# Altium schematic sheet microphone_stage.SchDoc
size A
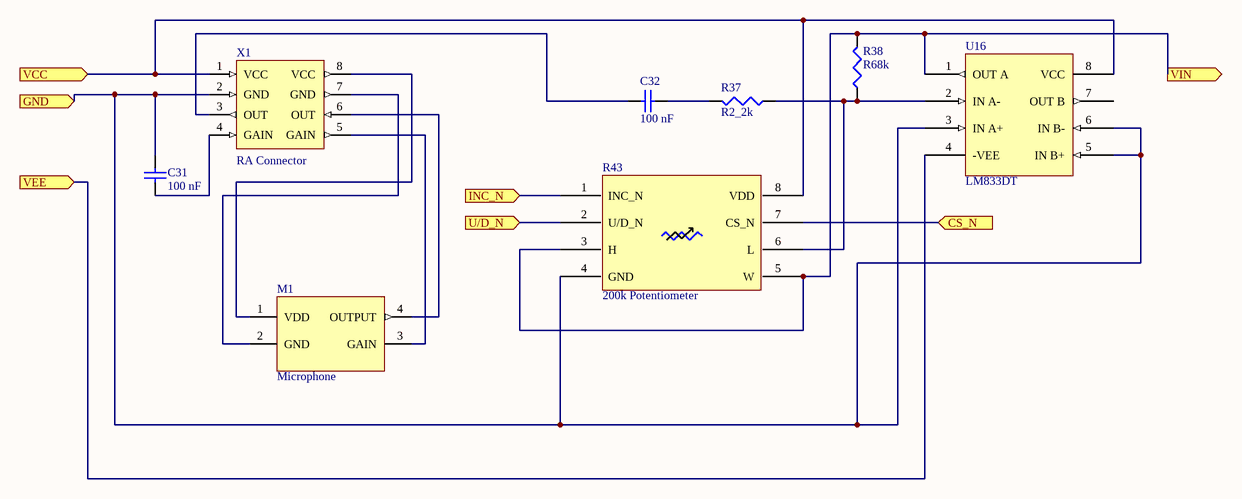
[diagram p0: microphone_stage.SchDoc]

## Parts
C31  100 nF  [C0603]
C32  100 nF  [C0603]
M1  Microphone  [SPU0414HR5H-SB-7]
R37  R2_2k  [R0603]
R38  R68k  [R0603]
R43  200k Potentiometer  [8-TSSOP]
U16  LM833DT  [soic8]
X1  RA Connector  [951104-7622-AR]

## Ports
CS_N (in), GND (in), INC_N (in), U/D_N (in), VCC (in), VEE (in), VIN (out)

## Nets
CS_N: R43.7(CS_N) ; port CS_N
GND: C31.2 R43.4(GND) U16.3(IN_A+) U16.5(IN_B+) U16.6(IN_B-) X1.2(GND) ; port GND
INC_N: R43.1(INC_N) ; port INC_N
U/D_N: R43.2(U/D_N) ; port U/D_N
VCC: R43.8(VDD) U16.8(VCC) X1.1(VCC) ; port VCC
VEE: U16.4(-VEE) ; port VEE
VIN: R38.2 R43.3(H) R43.5(W) U16.1(OUT_A) ; port VIN
NetC31_1: C31.1 X1.4(GAIN)
NetC32_1: C32.1 X1.3(OUT)
NetC32_2: C32.2 R37.2
NetM1_1: M1.1(VDD) X1.8(VCC)
NetM1_2: M1.2(GND) X1.7(GND)
NetM1_3: M1.3(GAIN) X1.5(GAIN)
NetM1_4: M1.4(OUTPUT) X1.6(OUT)
NetR37_1: R37.1 R38.1 R43.6(L) U16.2(IN_A-)

Not connected (* = marked no-connect by the designer): U16 7(OUT_B)

## Library data of the parts
C31 C32 = C100nF: 100 nF Surface Mount Capacitor; Manufacturer: Murata Electronics North America; Manufacturer Part Number: GRM188R71C104KA01D; Capacitance: 0.10µF; Tolerance: ±10%; Voltage - Rated: 16V; Temperature Coefficient: X7R; Supplier 1: Digi-Key; RoHS: RoHS Compliant; Category: Capacitors; Stock 1: 4165009; Pricing 1: 1=0.1, 10=0.019, 50=0.0102, 100=0.0086, 250=0.00704, 500=0.006, 1000=0.00468 (USD); Packaging: Digi-Reel®; Part Status: Active; Operating Temperature: -55°C ~ 125°C; Features: -; Ratings: -; Applications: General Purpose; Mounting Type: Surface Mount, MLCC; Package / Case: 0603 (1608 Metric); Size / Dimension: 0.063" L x 0.031" W (1.60mm x 0.80mm); Height - Seated (Max): -; Thickness (Max): 0.035" (0.90mm); Lead Spacing: -; Lead Style: -; ComponentLink1URL: http://www.murata.com/~/media/webrenewal/support/library/catalog/products/capacitor/mlcc/c02e.pdf; ComponentLink1Description: http://www.murata.com/~/media/webrenewal/support/library/catalog/products/capacitor/mlcc/c02e.pdf; Supplier Part Number 1: 490-1532-6-ND
M1 = SPU0414HR5H-SB-7: MIC MEMS ANALOG OMNI -22DB; Manufacturer: Knowles; Direction: Omnidirectional; Frequency Range: 100Hz ~ 10kHz; Sensitivity: -22dB ±3dB @ 94dB SPL; S/N Ratio: 59dB; Impedance: 400 Ohm; Voltage Range: 1.5 ~ 3.6V; Current - Supply: 220µA; Port Location: Top; Seal Rating: None; Shape: Rectangular; Supplier 1: Digi-Key; Manufacturer Part Number: SPU0414HR5H-SB-7; RoHS: RoHS Compliant; Category: Audio Products; Stock 1: 124760; Pricing 1: 1=2.01, 10=1.748, 25=1.3596, 50=1.23, 100=1.1005, 250=1.06812, 500=1.03576, 1000=0.93866 (USD); Packaging: Digi-Reel®; Part Status: Active; Type: MEMS (Silicon); Output Type: Analog; Voltage - Rated: -; Termination: Surface Mount; Size / Dimension: 3.76mm L x 2.95mm W; Height (Max): 1.20mm; ComponentLink1URL: http://www.knowles.com/eng/content/download/3915/49630/version/7/file/SPU0414HR5H-SB.pdf; ComponentLink1Description: http://www.knowles.com/eng/content/download/3915/49630/version/7/file/SPU0414HR5H-SB.pdf; Supplier Part Number 1: 423-1134-6-ND
R37 = R2_2k: 2.2k Ohms Surface Mount Resistor; Manufacturer: Yageo; Manufacturer Part Number: RC0603FR-072K2L; Tolerance: ±1%; Power (Watts): 0.1W, 1/10W; Temperature Coefficient: ±100ppm/°C; Supplier 1: Digi-Key; RoHS: RoHS Compliant; Category: Resistors; Stock 1: 4524664; Pricing 1: 1=0.1, 10=0.013, 25=0.0092, 50=0.007, 100=0.0052, 250=0.00396, 500=0.00316, 1000=0.00233 (USD); Packaging: Digi-Reel®; Part Status: Active; Resistance (Ohms): 2.2k; Composition: Thick Film; Features: Moisture Resistant; Operating Temperature: -55°C ~ 155°C; Package / Case: 0603 (1608 Metric); Supplier Device Package: 0603; Size / Dimension: 0.063" L x 0.031" W (1.60mm x 0.80mm); Height - Seated (Max): 0.022" (0.55mm); Number of Terminations: 2; Failure Rate: -; ComponentLink1URL: http://www.yageo.com/NewPortal/yageodocoutput?fileName=/pdf/R-Chip/PYu-RC_Group_51_RoHS_L_4.pdf; ComponentLink1Description: http://www.yageo.com/NewPortal/yageodocoutput?fileName=/pdf/R-Chip/PYu-RC_Group_51_RoHS_L_4.pdf; Supplier Part Number 1: 311-2.20KHRDKR-ND
R38 = R68k: 68k Ohms Surface Mount Resistor; Manufacturer: Panasonic Electronic Components; Manufacturer Part Number: ERJ-3EKF6802V; Tolerance: ±1%; Power (Watts): 0.1W, 1/10W; Temperature Coefficient: ±100ppm/°C; Supplier 1: Digi-Key; RoHS: RoHS Compliant; Category: Resistors; Stock 1: 139857; Pricing 1: 1=0.1, 10=0.019, 25=0.0136, 50=0.0104, 100=0.0077, 250=0.00584, 500=0.00468, 1000=0.00345 (USD); Packaging: Cut Tape (CT); Part Status: Active; Resistance (Ohms): 68k; Composition: Thick Film; Features: Automotive AEC-Q200; Operating Temperature: -55°C ~ 155°C; Package / Case: 0603 (1608 Metric); Supplier Device Package: 0603; Size / Dimension: 0.063" L x 0.031" W (1.60mm x 0.80mm); Height - Seated (Max): 0.022" (0.55mm); Number of Terminations: 2; Failure Rate: -; ComponentLink1URL: https://industrial.panasonic.com/cdbs/www-data/pdf/RDA0000/AOA0000C283.pdf; ComponentLink1Description: https://industrial.panasonic.com/cdbs/www-data/pdf/RDA0000/AOA0000C283.pdf; Supplier Part Number 1: P68.0KHCT-ND
R43 = MAX5160NEUA: 200k Digital Potentiometer (32 Tap); Manufacturer: Maxim Integrated; Manufacturer Part Number: MAX5160NEUA+; Number of Circuits: 1; Number of Taps: 32; Interface: Up/Down (U/D, INC, CS); Memory Type: Volatile; Voltage - Supply: 2.7 V ~ 5.5 V; Tolerance: ±25%; Temperature Coefficient (Typ): 50 ppm/°C; Resistance - Wiper (Ohms) (Typ): 400; Supplier 1: Digi-Key; RoHS: RoHS Compliant; Category: Integrated Circuits (ICs); Stock 1: 274; Pricing 1: 1=0.87, 10=0.83 (USD); Packaging: Tube; Part Status: Active; Taper: Linear; Configuration: Potentiometer; Resistance (Ohms): 200k; Features: -; Operating Temperature: -40°C ~ 85°C; Package / Case: 8-TSSOP, 8-MSOP (0.118", 3.00mm Width); Supplier Device Package: 8-uMAX; ComponentLink1URL: https://datasheets.maximintegrated.com/en/ds/MAX5160-MAX5161.pdf; ComponentLink1Description: https://datasheets.maximintegrated.com/en/ds/MAX5160-MAX5161.pdf; Supplier Part Number 1: MAX5160NEUA+-ND
U16 = LM833DT: IC Dual Audio Amplifier; Manufacturer: STMicroelectronics; Number of Circuits: 2; Slew Rate: 7 V/µs; Gain Bandwidth Product: 15MHz; Current - Input Bias: 300nA; Voltage - Input Offset: 300µV; Current - Supply: 4mA; Voltage - Supply, Single/Dual (±): 5 V ~ 30 V, ±2.5 V ~ 15 V; Supplier 1: Digi-Key; Manufacturer Part Number: LM833DT; RoHS: RoHS Compliant; Category: Integrated Circuits (ICs); Stock 1: 35363; Pricing 1: 1=0.45, 10=0.382, 100=0.2855, 500=0.22434, 1000=0.17335 (USD); Packaging: Cut Tape (CT); Part Status: Active; Amplifier Type: Audio; Output Type: -; -3db Bandwidth: -; Current - Output / Channel: -; Operating Temperature: -40°C ~ 105°C; Mounting Type: Surface Mount; Package / Case: 8-SOIC (0.154", 3.90mm Width); Supplier Device Package: 8-SO; ComponentLink1URL: http://www.st.com/content/ccc/resource/technical/document/datasheet/3b/52/12/a5/70/7c/44/0a/CD00000470.pdf/files/CD00000470.pdf/jcr:content/translations/en.CD00000470.pdf; ComponentLink1Description: http://www.st.com/content/ccc/resource/technical/document/datasheet/3b/52/12/a5/70/7c/44/0a/CD00000470.pdf/files/CD00000470.pdf/jcr:content/translations/en.CD00000470.pdf; Supplier Part Number 1: 497-1597-1-ND
X1 = HPM-06-02-T-S-RA: Right Angle Board-to-Board Connector; Manufacturer: 3M; Connector Type: Header, Unshrouded; Number of Positions: 4; Number of Positions Loaded: All; Pitch: 0.079" (2.00mm); Supplier 1: Digi-Key; Manufacturer Part Number: 951104-7622-AR; RoHS: RoHS Compliant; Category: Connectors, Interconnects; Stock 1: 4791; Pricing 1: 1=0.41, 10=0.385, 25=0.33, 50=0.2806, 100=0.2695, 250=0.242, 500=0.231, 1000=0.1925, 2500=0.176 (USD); Packaging: Bulk; Part Status: Active; Number of Rows: 1; Row Spacing: -; Contact Mating Length: 0.173" (4.40mm); Mounting Type: Through Hole, Right Angle; Termination: Solder; Contact Finish: Gold; Contact Finish Thickness: Flash; Features: -; Color: Black; ComponentLink1URL: http://multimedia.3m.com/mws/media/438474O/3mtm-pin-strip-header-ts2156.pdf; ComponentLink1Description: http://multimedia.3m.com/mws/media/438474O/3mtm-pin-strip-header-ts2156.pdf; Supplier Part Number 1: 3M9306-ND; Contact Type: Male Pin; Fastening Type: -